# EasyEDA schematic SCH_floatproj_2024-04-08.json
TITLE: Sheet_1; REV: 1.0; Date: 2024-04-08; Sheet: 1/1; Drawn By: waleedbookey; Company: Your Company
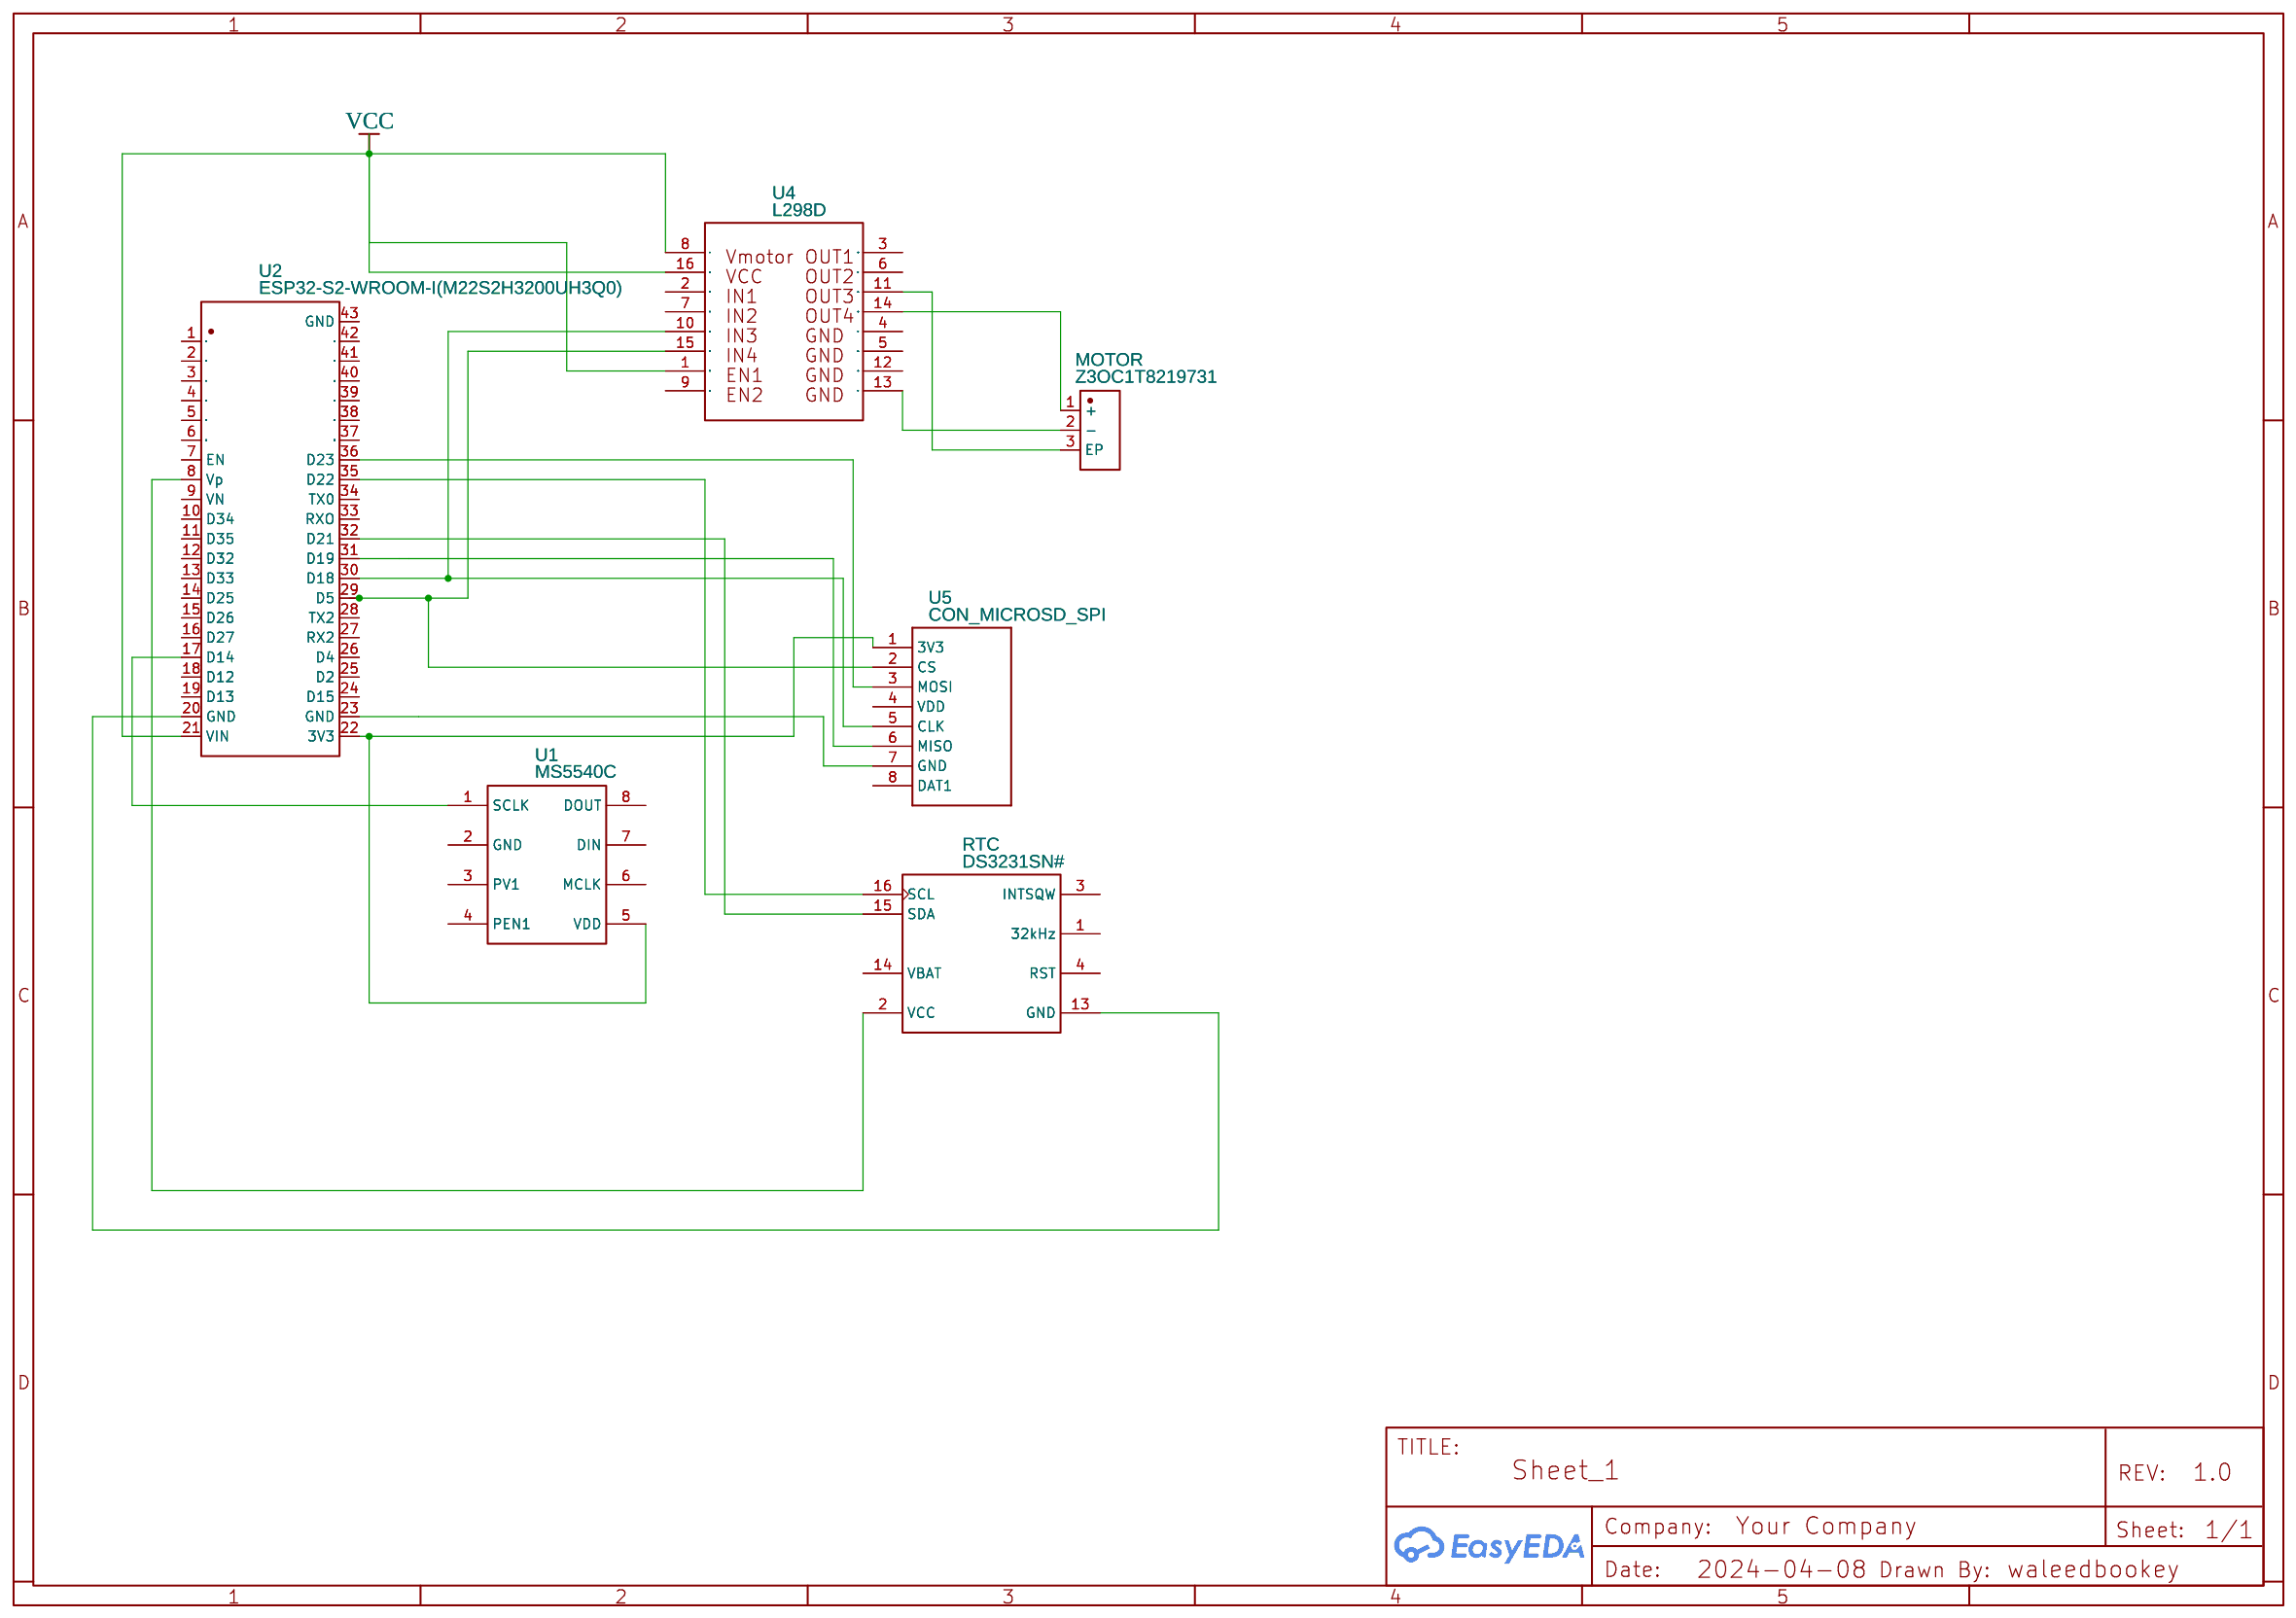
[diagram p0: schematic sheet]

## Parts
MOTOR  Z3OC1T8219731  [VIBRATING-MOTOR-SMD_3P-C9900001680]
RTC  DS3231SN#  [SOIC-16_L10.3-W7.5-P1.27-LS10.3-BL]
U1  MS5540C
U2  ESP32-S2-WROOM-I(M22S2H3200UH3Q0)  [WIFI-SMD_ESP32-S2-WROOM-I-1]
U4  L298D
U5  CON_MICROSD_SPI  [CON_MICROSD_HINGED]

## Library data of the parts
MOTOR = Z3OC1T8219731: Contributor: LCSC; Supplier: LCSC; Supplier Part: C2894731; Manufacturer: KOTL(金龙机电); JLCPCB Part Class: Extended Part
RTC = DS3231SN#: tags: Clock; subpart_no: 1; image: http://image.lceda.cn/szlcsc/C9866.jpg; Supplier Part: C9866; Supplier: LCSC; Manufacturer: ADI(亚德诺)/MAXIM(美信); Manufacturer Part: DS3231SN#T&R; JLCPCB Part Class: Extended Part
U1 = MS5540C: Contributor: freetyrael
U2 = ESP32-S2-WROOM-I(M22S2H3200UH3Q0): Supplier: LCSC; Supplier Part: C6191504; Manufacturer: ESPRESSIF(乐鑫); Contributor: lcsc
U4 = L298D: Contributor: KESHAV SONI
U5 = CON_MICROSD: Contributor: DangerousPrototype

## Nets
VCC: U2.21(VIN) U4.1(21) U4.8(1) U4.16(2)
Net-(MOTOR-1): MOTOR.1(+) U4.14(15)
Net-(MOTOR-2): MOTOR.2(-) U4.13(11)
Net-(MOTOR-3): MOTOR.3(EP) U4.11(16)
Net-(RTC-2): RTC.2(VCC) U2.8(Vp)
Net-(RTC-13): RTC.13(GND) U2.20(GND)
Net-(RTC-15): RTC.15(SDA) U2.32(D21)
Net-(RTC-16): RTC.16(SCL) U2.35(D22)
Net-(U1-1): U1.1(SCLK) U2.17(D14)
Net-(U1-5): U1.5(VDD) U2.22(3V3) U5.1(3V3)
Net-(U2-23): U2.23(GND) U5.7(GND)
Net-(U2-29): U2.29(D5) U4.15(22) U5.2(CS)
Net-(U2-30): U2.30(D18) U4.10(23) U5.5(CLK)
Net-(U2-31): U2.31(D19) U5.6(MISO)
Net-(U2-36): U2.36(D23) U5.3(MOSI)

Not connected (* = marked no-connect by the designer): RTC 1(32kHz) 3(INTSQW) 4(RST) 14(VBAT); U1 2(GND) 3(PV1) 4(PEN1) 6(MCLK) 7(DIN) 8(DOUT); U2 1(EN) 2(VP) 3(VN) 4(0) 5(0) 6(IO3) 7(EN) 9(VN) 10(D34) 11(D35) 12(D32) 13(D33) 14(D25) 15(D26) 16(D27) 18(D12) 19(D13) 24(D15) 25(D2) 26(D4) 27(RX2) 28(TX2) 33(RXO) 34(TX0) 37(TXD0) 38(RXD0) 39(D21) 40(D19) 41(D22) 42(D23) 43(GND); U4 2(25) 3(18) 4(14) 5(13) 6(17) 7(24) 9(20) 12; U5 4(VDD) 8(DAT1)
